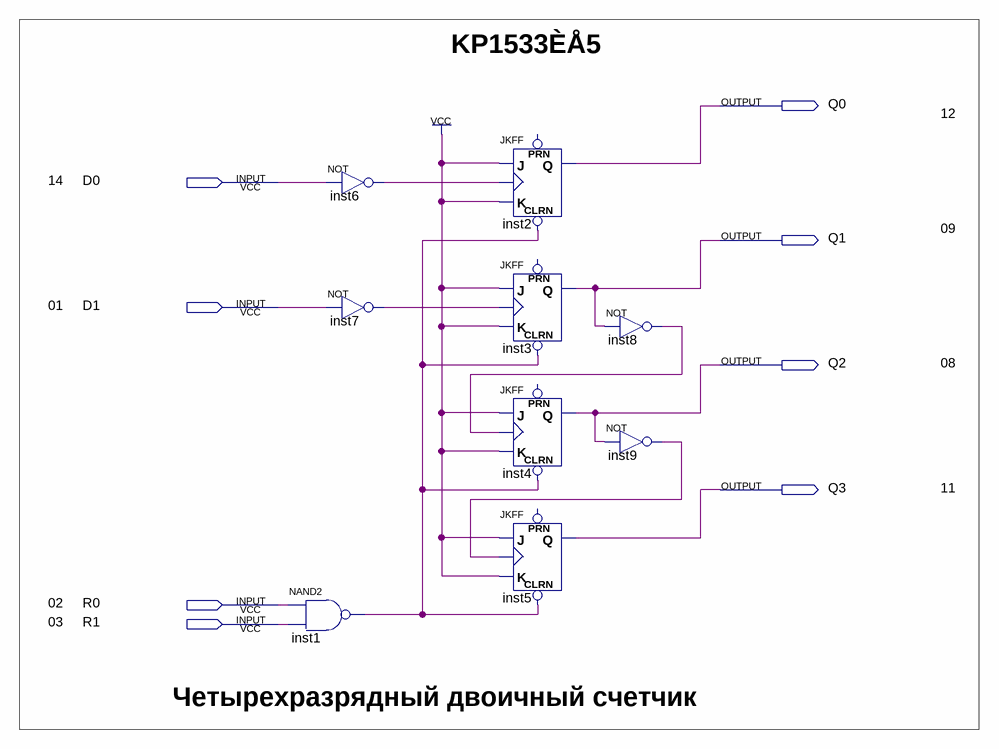
[diagram p0: schematic sheet]
// Quartus schematic KP1533IE5.bdf as structural Verilog: 9 symbols, 8 pins
module KP1533IE5 (
  input  D0,
  input  D1,
  input  R0,
  input  R1,
  output Q0,
  output Q1,
  output Q2,
  output Q3
);

  wire inst1_out, inst6_out, inst7_out, inst8_out, inst9_out;

  nand inst1 (inst1_out, R0, R1);
  not inst6 (inst6_out, D0);
  not inst7 (inst7_out, D1);
  JKFF inst2 (.CLRN(inst1_out), .K(1'b1), .J(1'b1), .CLK(inst6_out), .Q(Q0));  // open: PRN
  JKFF inst3 (.CLRN(inst1_out), .K(1'b1), .J(1'b1), .CLK(inst7_out), .Q(Q1));  // open: PRN
  JKFF inst4 (.CLRN(inst1_out), .K(1'b1), .J(1'b1), .CLK(inst8_out), .Q(Q2));  // open: PRN
  JKFF inst5 (.CLRN(inst1_out), .K(1'b1), .J(1'b1), .CLK(inst9_out), .Q(Q3));  // open: PRN
  not inst8 (inst8_out, Q1);
  not inst9 (inst9_out, Q2);

  // Notes on the sheet:
  //   KP1533ÈÅ5
  //   12
  //   14
  //   09
  //   01
  //   08
  //   11
  //   02
  //   03
  //   Четырехразрядный двоичный счетчик
endmodule
